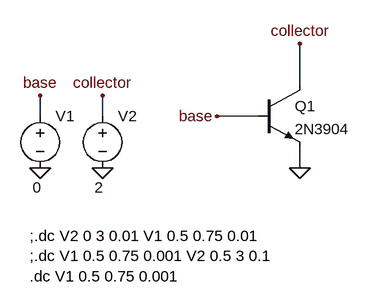
[diagram p0: schematic fig1.asc]
fig1.asc, the LTspice schematic file:
Version 4
SHEET 1 1620 680
WIRE -288 48 -288 -16
WIRE -688 96 -688 64
WIRE -592 96 -592 64
WIRE -352 96 -416 96
WIRE -288 176 -288 144
FLAG -688 64 base
FLAG -592 176 0
FLAG -592 64 collector
FLAG -688 176 0
FLAG -416 96 base
FLAG -288 -16 collector
FLAG -288 176 0
SYMBOL voltage -592 80 R0
WINDOW 123 0 0 Left 0
WINDOW 39 0 0 Left 0
WINDOW 3 -12 126 Left 2
SYMATTR Value 2
SYMATTR InstName V2
SYMBOL voltage -688 80 R0
WINDOW 123 0 0 Left 0
WINDOW 39 0 0 Left 0
WINDOW 3 -12 126 Left 2
SYMATTR Value 0
SYMATTR InstName V1
SYMBOL npn -352 48 R0
SYMATTR InstName Q1
SYMATTR Value 2N3904
TEXT -704 280 Left 2 !;.dc V2 0 3 0.01 V1 0.5 0.75 0.01\n;.dc V1 0.5 0.75 0.001 V2 0.5 3 0.1\n.dc V1 0.5 0.75 0.001

The netlist it stands for:
* fig1.asc
V2 collector 0 2
V1 base 0 0
Q1 collector base 0 0 2N3904
.model NPN NPN
.model PNP PNP
.lib standard.bjt
;.dc V2 0 3 0.01 V1 0.5 0.75 0.01
;.dc V1 0.5 0.75 0.001 V2 0.5 3 0.1
.dc V1 0.5 0.75 0.001
.backanno
.end

* Results of the author's LTspice run, read from the files saved beside the schematic
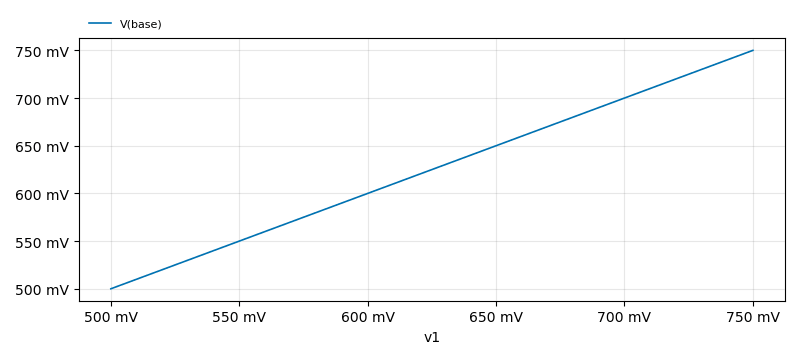
[diagram p1: DC transfer characteristic of fig1.asc, plotted from the saved traces]
* DC transfer characteristic, 1 run:
*   V(base): 500 mV at v1=500 mV, 750 mV at v1=750 mV, min 500 mV, max 750 mV